# Altium schematic sheet koosh_sensor_top_lighthouse.SchDoc
size A
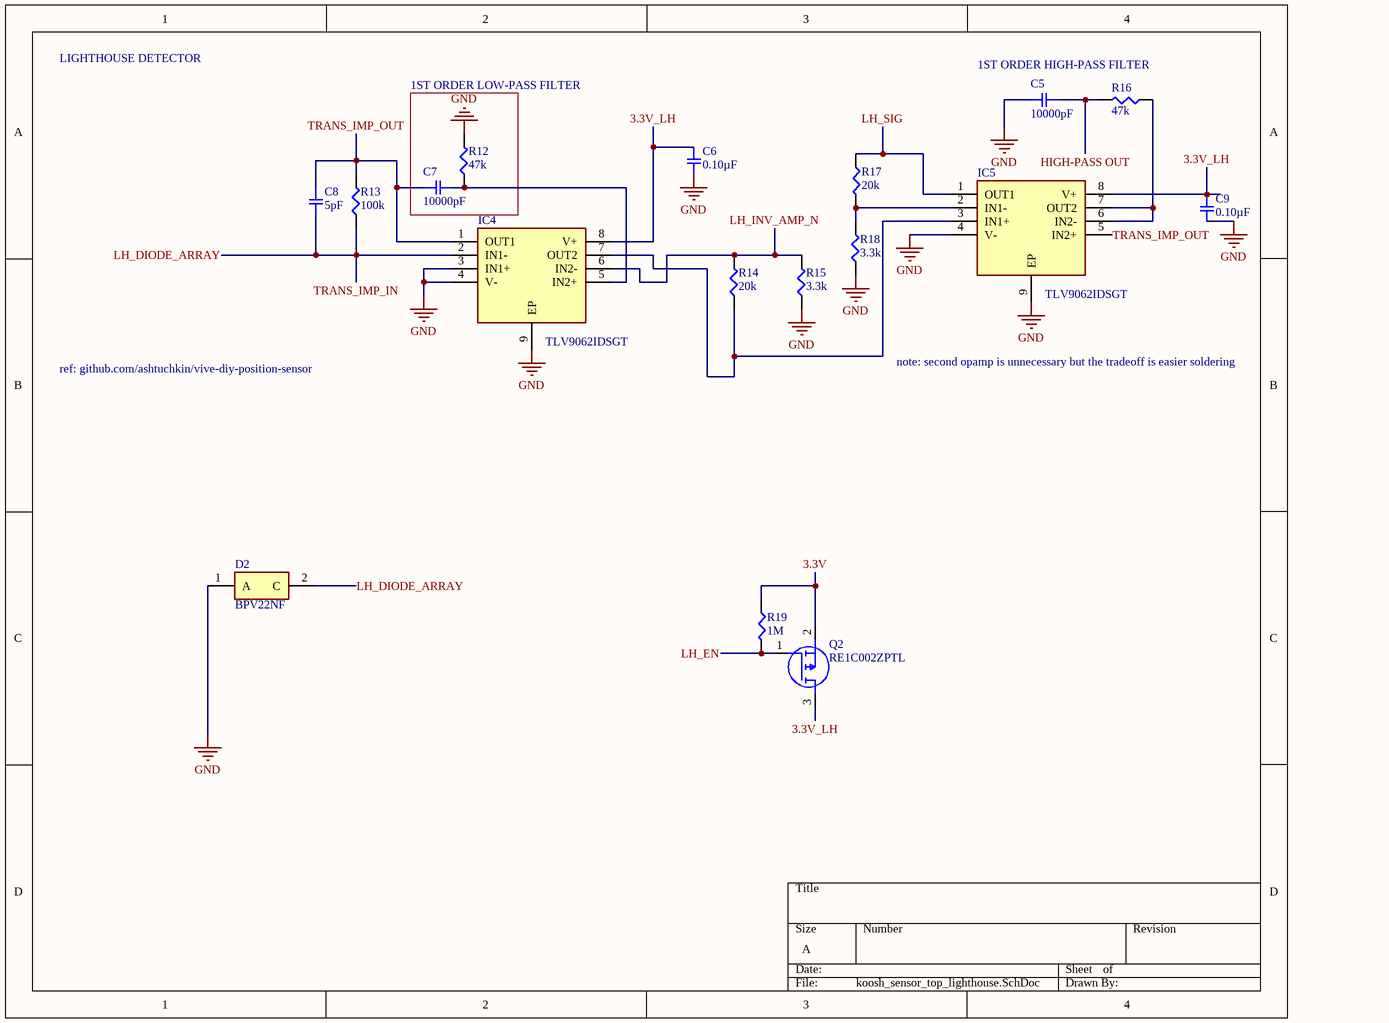
[diagram p0: koosh_sensor_top_lighthouse.SchDoc]

## Parts
C5  10000pF  [SMD-0402C]
C6  0.10µF  [SMD-0402C]
C7  10000pF  [SMD-0402C]
C8  5pF  [SMD-0402C]
C9  0.10µF  [SMD-0402C]
D2  BPV22NF  [TO254P510X450X920-2P]
IC4  TLV9062IDSGT  [SON50P200X200X80-9N]
IC5  TLV9062IDSGT  [SON50P200X200X80-9N]
Q2  RE1C002ZPTL  [SOTFL50P160X85-3N]
R12  47k  [SMD-0402-RES]
R13  100k  [SMD-0402-RES]
R14  20k  [SMD-0402-RES]
R15  3.3k  [SMD-0402-RES]
R16  47k  [SMD-0402-RES]
R17  20k  [SMD-0402-RES]
R18  3.3k  [SMD-0402-RES]
R19  1M  [SMD-0402-RES]

## Blocks framed on the sheet
1ST ORDER LOW-PASS FILTER: C7 R12

## Nets
GND: C5.2 C6.2 C9.2 D2.1(A) IC4.3(IN1+) IC4.4(V-) IC4.9(EP) IC5.4(V-) IC5.9(EP) R12.2 R15.1 R18.1
3.3V: Q2.2(S) R19.1
3.3V_LH: C6.1 C9.1 IC4.8(V+) IC5.8(V+) Q2.3(D)
HIGH-PASS OUT: C5.1 R16.2
LH_DIODE_ARRAY: C8.2 D2.2(C) IC4.2(IN1-) R13.1  [also labelled TRANS_IMP_IN]
LH_EN: Q2.1(G) R19.2
LH_INV_AMP_N: IC4.6(IN2-) R14.2 R15.2
LH_SIG: IC5.1(OUT1) R17.1
TRANS_IMP_OUT: C7.1 C8.1 IC4.1(OUT1) IC5.5(IN2+) R13.2
NetC7_2: C7.2 IC4.5(IN2+) R12.1
NetIC4_7: IC4.7(OUT2) IC5.3(IN1+) R14.1
NetIC5_2: IC5.2(IN1-) R17.2 R18.2
NetIC5_6: IC5.6(IN2-) IC5.7(OUT2) R16.1

## Notes on the sheet
- LIGHTHOUSE DETECTOR
- 1ST ORDER HIGH-PASS FILTER
- ref: github.com/ashtuchkin/vive-diy-position-sensor
- note: second opamp is unnecessary but the tradeoff is easier soldering

## Library data of the parts
C5 C7 = GCM155R71H103KA55D: CAP CER 10000PF 50V X7R 0402; Manufacturer: Murata Electronics North America; Factory Stock: 0; Unit Price (USD): 0.1; Minimum Quantity: 1; Tolerance: ±10%; Datasheets: http://www.murata.com/~/media/webrenewal/support/library/catalog/products/capacitor/mlcc/c03e.ashx; Image: //media.digikey.com/Renders/Murata%20Renders/ZRB-SERIES-0402.jpg; Digi-Key Part Number: 490-4762-1-ND; Part Number: GCM155R71H103KA55D; Quantity Available: 650067; @ qty: 0; Packaging: Cut Tape (CT); Series: GCM; Part Status: Active; Value: 10000pF; Voltage: 50V; Temperature Coefficient: X7R; Operating Temperature: -55°C ~ 125°C; Features: -; Ratings: AEC-Q200; Applications: Automotive; Mounting Type: Surface Mount, MLCC; Package / Case: 0402 (1005 Metric); Size / Dimension: 0.039" L x 0.020" W (1.00mm x 0.50mm); Height - Seated (Max): -; Thickness (Max): 0.022" (0.55mm); Lead Spacing: -; Lead Style: -
C6 C9 = GCM155R71C104KA55D: CAP CER 0.1UF 16V X7R 0402; Manufacturer: Murata Electronics North America; Factory Stock: 0; Unit Price (USD): 0.1; Minimum Quantity: 1; Tolerance: ±10%; Datasheets: http://www.murata.com/~/media/webrenewal/support/library/catalog/products/capacitor/mlcc/c03e.ashx; Image: //media.digikey.com/Renders/Murata%20Renders/ZRB-SERIES-0402.jpg; Digi-Key Part Number: 490-4759-1-ND; Part Number: GCM155R71C104KA55D; Quantity Available: 734194; @ qty: 0; Packaging: Cut Tape (CT); Series: GCM; Part Status: Active; Value: 0.10µF; Voltage: 16V; Temperature Coefficient: X7R; Operating Temperature: -55°C ~ 125°C; Features: -; Ratings: AEC-Q200; Applications: Automotive; Mounting Type: Surface Mount, MLCC; Package / Case: 0402 (1005 Metric); Size / Dimension: 0.039" L x 0.020" W (1.00mm x 0.50mm); Height - Seated (Max): -; Thickness (Max): 0.022" (0.55mm); Lead Spacing: -; Lead Style: -
C8 = GJM1555C1H5R0BB01D: CAP CER 5PF 50V NP0 0402; Manufacturer: Murata Electronics North America; Factory Stock: 0; Unit Price (USD): 0.2; Minimum Quantity: 1; Tolerance: ±0.1pF; Temperature Coefficient: C0G, NP0; Datasheets: http://www.murata.com/~/media/webrenewal/support/library/catalog/products/capacitor/mlcc/c02e.pdf; Image: //media.digikey.com/Renders/Murata%20Renders/ZRB-SERIES-0402.jpg; Digi-Key Part Number: 490-8103-1-ND; Part Number: GJM1555C1H5R0BB01D; Quantity Available: 17055; @ qty: 0; Packaging: Cut Tape (CT); Series: GJM; Part Status: Active; Value: 5pF; Voltage: 50V; Operating Temperature: -55°C ~ 125°C; Features: High Q, Low Loss; Ratings: -; Applications: RF, Microwave, High Frequency; Mounting Type: Surface Mount, MLCC; Package / Case: 0402 (1005 Metric); Size / Dimension: 0.039" L x 0.020" W (1.00mm x 0.50mm); Height - Seated (Max): -; Thickness (Max): 0.022" (0.55mm); Lead Spacing: -; Lead Style: -
D2 = BPV22NF: Diode; Manufacturer_Name: Vishay; Allied_Number: R1086877; Datasheet Link: http://www.vishay.com/docs/81509/bpv22nf.pdf; Height: 5.1mm; Manufacturer_Part_Number: BPV22NF; Mouser Part Number: 782-BPV22NF; Mouser Price/Stock: https://www.mouser.com/Search/Refine.aspx?Keyword=782-BPV22NF; RS Part Number: 6997604P; RS Price/Stock: http://uk.rs-online.com/web/p/products/6997604P; Allied Price/Stock: https://www.alliedelec.com/vishay-dale-bpv22nf/R1086877/
IC4 IC5 = TLV9062IDSGT: Integrated Circuit; Manufacturer_Name: Texas Instruments; Datasheet Link: http://www.ti.com/lit/gpn/TLV9062; Height: 0.8mm; Manufacturer_Part_Number: TLV9062IDSGT; Mouser Part Number: 595-TLV9062IDSGT; Mouser Price/Stock: https://www.mouser.com/Search/Refine.aspx?Keyword=595-TLV9062IDSGT
Q2 = RE1C002ZPTL: MOSFET (P-Channel); Manufacturer_Name: ROHM Semiconductor; Datasheet Link: https://componentsearchengine.com/Datasheets/1/RE1C002ZPTL.pdf; Height: 0.85mm; Manufacturer_Part_Number: RE1C002ZPTL; Mouser Part Number: 755-RE1C002ZPTL; Mouser Price/Stock: https://www.mouser.com/Search/Refine.aspx?Keyword=755-RE1C002ZPTL; RS Part Number: 1486960P; RS Price/Stock: http://uk.rs-online.com/web/p/products/1486960P
R12 R16 = ERJ-2GEJ473X: RES SMD 47K OHM 5% 1/10W 0402; Manufacturer: Panasonic Electronic Components; Factory Stock: 0; Unit Price (USD): 0.00350; @ qty: 1500; Minimum Quantity: 1; Power (Watts): 0.1W, 1/10W; Temperature Coefficient: ±200ppm/°C; Part Number: ERJ-2GEJ473X; Datasheets: http://industrial.panasonic.com/www-cgi/jvcr13pz.cgi?E+PZ+3+AOA0001+ERJ2GEJ473X+7+WW; Image: //media.digikey.com/Photos/Panasonic%20Photos/ERJ-PA2-Series.jpg; Digi-Key Part Number: P47KJCT-ND; Quantity Available: 5182645; Packaging: Cut Tape (CT); Series: ERJ; Part Status: Active; Value: 47k; Tolerance: ±5%; Composition: Thick Film; Features: Automotive AEC-Q200; Operating Temperature: -55°C ~ 155°C; Package / Case: 0402 (1005 Metric); Supplier Device Package: 0402; Size / Dimension: 0.039" L x 0.020" W (1.00mm x 0.50mm); Height - Seated (Max): 0.016" (0.40mm); Number of Terminations: 2; Failure Rate: -
R13 = ERJ-2GEJ104X: RES SMD 100K OHM 5% 1/10W 0402; Manufacturer: Panasonic Electronic Components; Factory Stock: 0; Unit Price (USD): 0.00350; @ qty: 1500; Minimum Quantity: 1; Power (Watts): 0.1W, 1/10W; Temperature Coefficient: ±200ppm/°C; Part Number: ERJ-2GEJ104X; Datasheets: http://industrial.panasonic.com/www-cgi/jvcr13pz.cgi?E+PZ+3+AOA0001+ERJ2GEJ104X+7+WW; Image: //media.digikey.com/Photos/Panasonic%20Photos/ERJ-PA2-Series.jpg; Digi-Key Part Number: P100KJCT-ND; Quantity Available: 2387986; Packaging: Cut Tape (CT); Series: ERJ; Part Status: Active; Value: 100k; Tolerance: ±5%; Composition: Thick Film; Features: Automotive AEC-Q200; Operating Temperature: -55°C ~ 155°C; Package / Case: 0402 (1005 Metric); Supplier Device Package: 0402; Size / Dimension: 0.039" L x 0.020" W (1.00mm x 0.50mm); Height - Seated (Max): 0.016" (0.40mm); Number of Terminations: 2; Failure Rate: -
R14 R17 = ERJ-2GEJ473X: RES SMD 20K OHM 5% 1/10W 0402; Manufacturer: Panasonic Electronic Components; Factory Stock: 0; Unit Price (USD): 0.00350; @ qty: 1500; Minimum Quantity: 1; Power (Watts): 0.1W, 1/10W; Temperature Coefficient: ±200ppm/°C; Part Number: ERJ-2GEJ473X; Datasheets: http://industrial.panasonic.com/www-cgi/jvcr13pz.cgi?E+PZ+3+AOA0001+ERJ2GEJ473X+7+WW; Image: //media.digikey.com/Photos/Panasonic%20Photos/ERJ-PA2-Series.jpg; Digi-Key Part Number: P47KJCT-ND; Quantity Available: 5182645; Packaging: Cut Tape (CT); Series: ERJ; Part Status: Active; Value: 20k; Tolerance: ±5%; Composition: Thick Film; Features: Automotive AEC-Q200; Operating Temperature: -55°C ~ 155°C; Package / Case: 0402 (1005 Metric); Supplier Device Package: 0402; Size / Dimension: 0.039" L x 0.020" W (1.00mm x 0.50mm); Height - Seated (Max): 0.016" (0.40mm); Number of Terminations: 2; Failure Rate: -
R15 R18 = ERJ-2GEJ332X: RES SMD 3.3K OHM 5% 1/10W 0402; Manufacturer: Panasonic Electronic Components; Factory Stock: 0; Unit Price (USD): 0.00350; @ qty: 1500; Minimum Quantity: 1; Power (Watts): 0.1W, 1/10W; Temperature Coefficient: ±200ppm/°C; Part Number: ERJ-2GEJ332X; Datasheets: http://industrial.panasonic.com/www-cgi/jvcr13pz.cgi?E+PZ+3+AOA0001+ERJ2GEJ332X+7+WW; Image: //media.digikey.com/Photos/Panasonic%20Photos/ERJ-PA2-Series.jpg; Digi-Key Part Number: P3.3KJCT-ND; Quantity Available: 514266; Packaging: Cut Tape (CT); Series: ERJ; Part Status: Active; Value: 3.3k; Tolerance: ±5%; Composition: Thick Film; Features: Automotive AEC-Q200; Operating Temperature: -55°C ~ 155°C; Package / Case: 0402 (1005 Metric); Supplier Device Package: 0402; Size / Dimension: 0.039" L x 0.020" W (1.00mm x 0.50mm); Height - Seated (Max): 0.016" (0.40mm); Number of Terminations: 2; Failure Rate: -
R19 = ERJ-2GEJ105X: RES SMD 1M OHM 5% 1/10W 0402; Manufacturer: Panasonic Electronic Components; Factory Stock: 0; Unit Price (USD): 0.00350; @ qty: 1500; Minimum Quantity: 1; Power (Watts): 0.1W, 1/10W; Temperature Coefficient: ±200ppm/°C; Part Number: ERJ-2GEJ105X; Datasheets: http://industrial.panasonic.com/www-cgi/jvcr13pz.cgi?E+PZ+3+AOA0001+ERJ2GEJ105X+7+WW; Image: //media.digikey.com/Photos/Panasonic%20Photos/ERJ-PA2-Series.jpg; Digi-Key Part Number: P1.0MJCT-ND; Quantity Available: 1082572; Packaging: Cut Tape (CT); Series: ERJ; Part Status: Active; Value: 1M; Tolerance: ±5%; Composition: Thick Film; Features: Automotive AEC-Q200; Operating Temperature: -55°C ~ 155°C; Package / Case: 0402 (1005 Metric); Supplier Device Package: 0402; Size / Dimension: 0.039" L x 0.020" W (1.00mm x 0.50mm); Height - Seated (Max): 0.016" (0.40mm); Number of Terminations: 2; Failure Rate: -